# Altium project Display_V1_1.PrjPcb
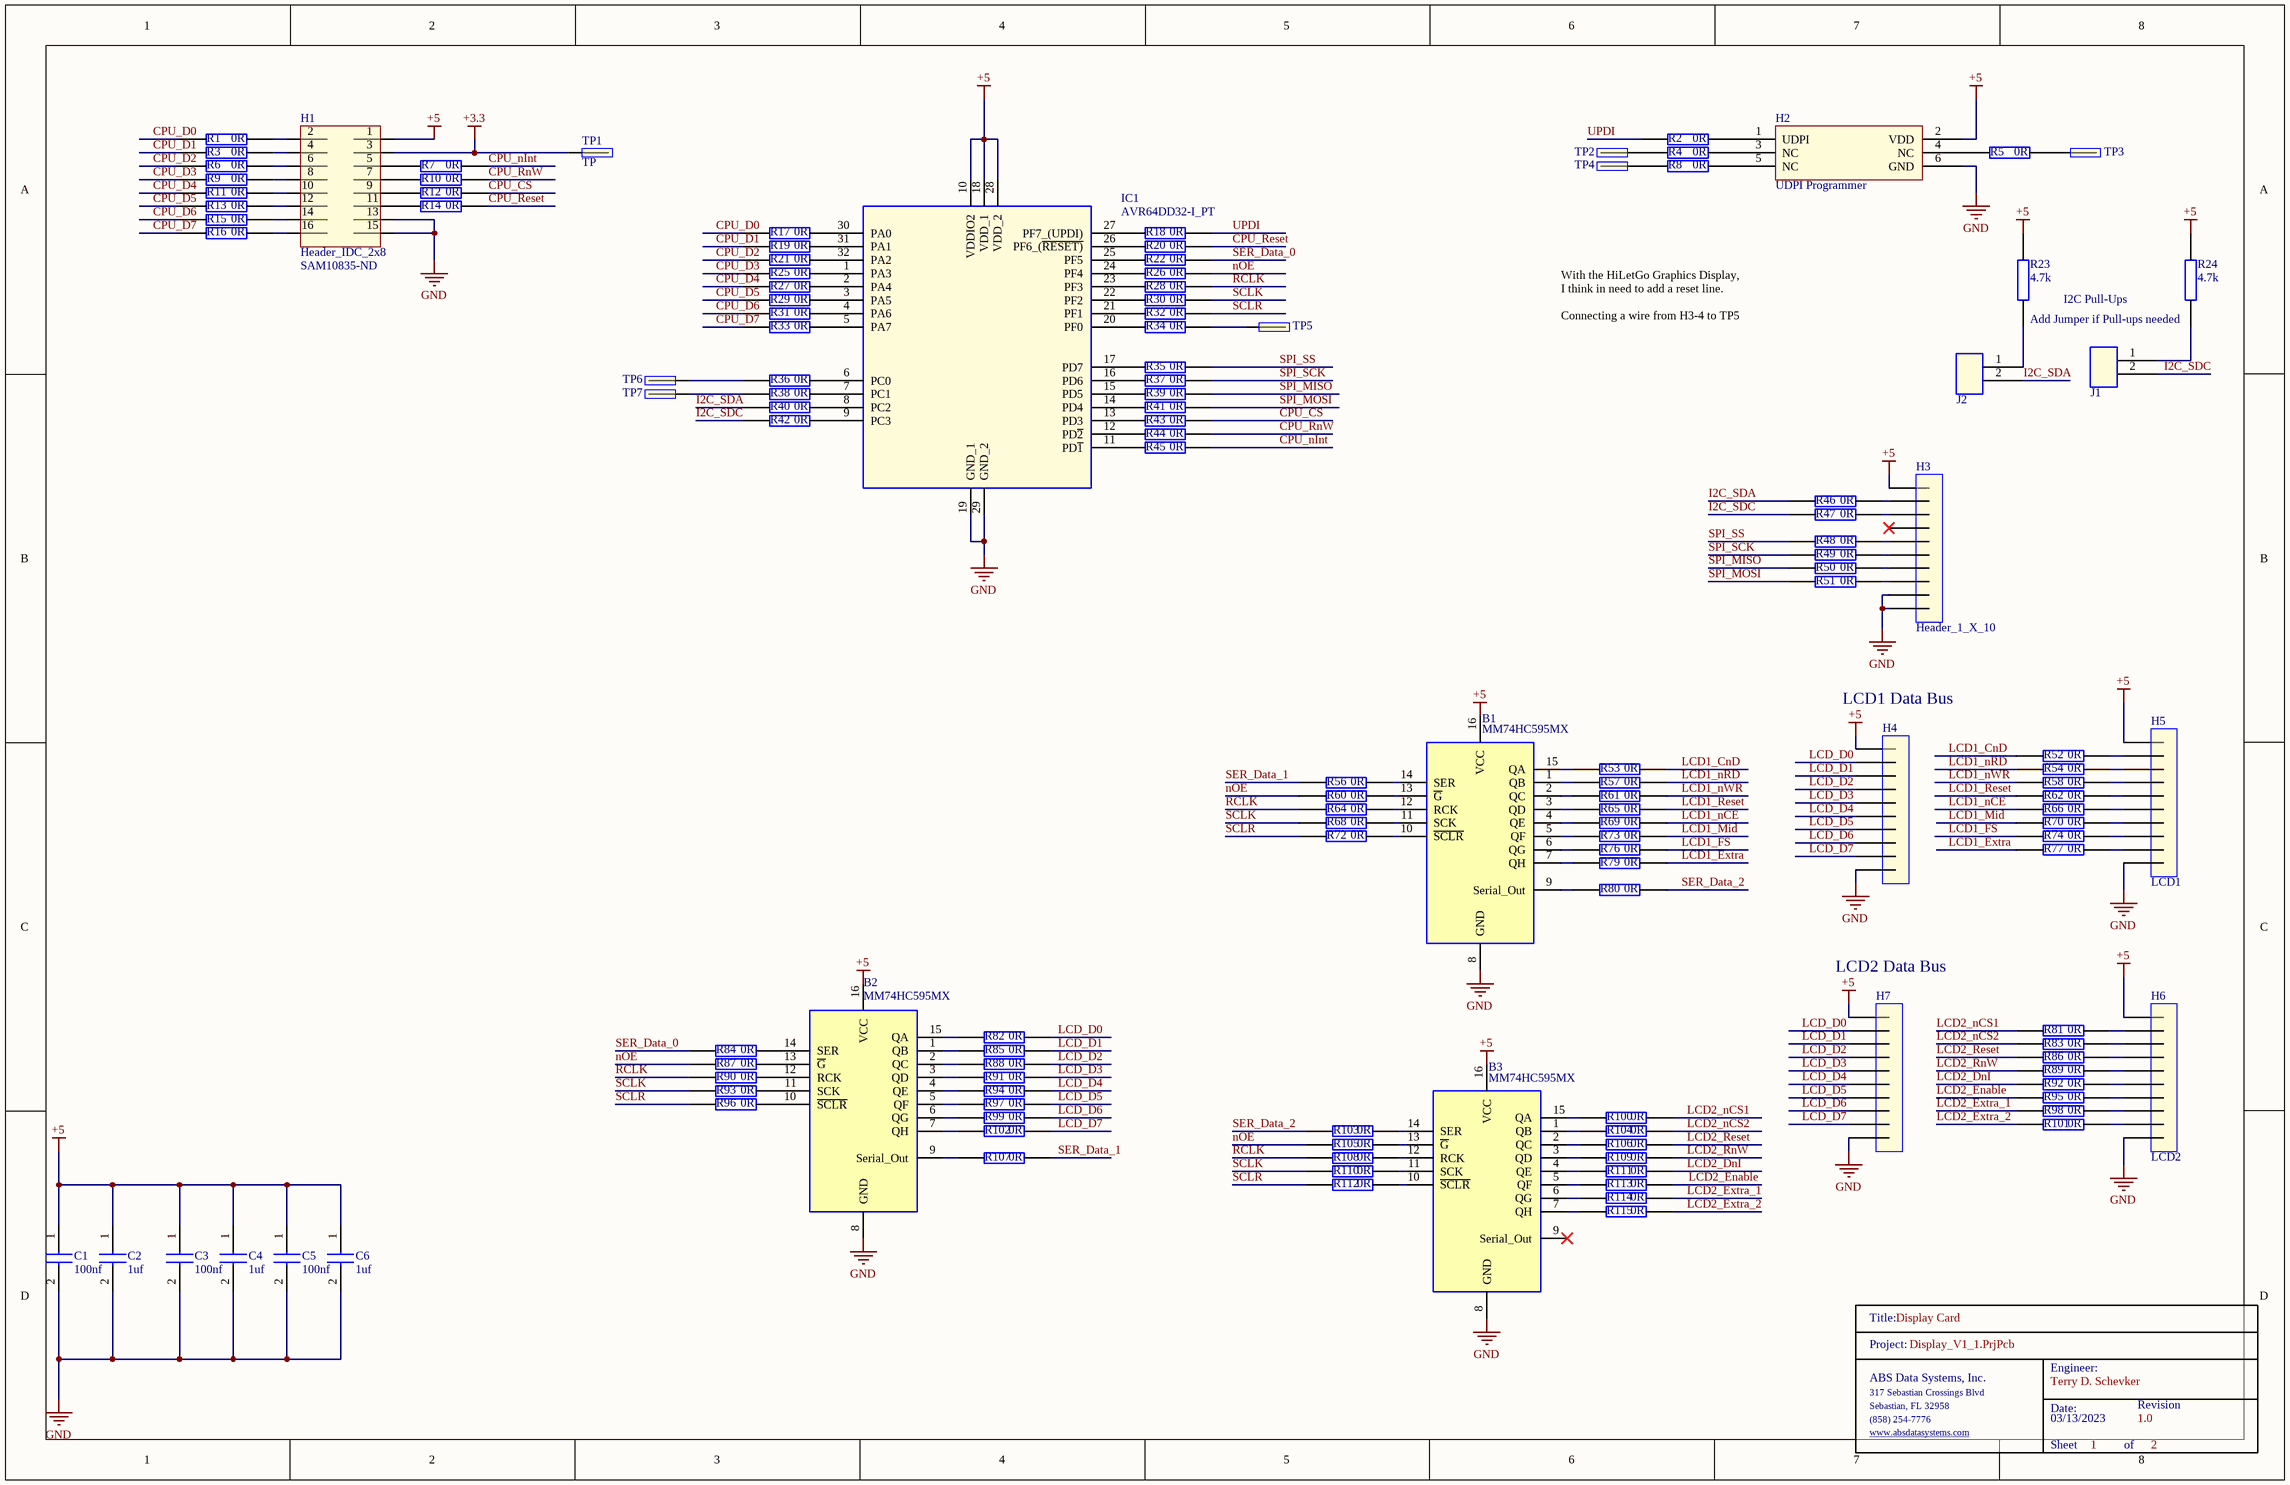
[diagram p0: Display_CPu.SchDoc]
2 sheets, 314 parts. Net scope: global (net labels, ports and power ports of the same name join across sheets).
Board file: Display_PCB.PcbDoc
Sheets:
  Display_CPu.SchDoc
  Display_LED_Monitor.SchDoc

## Sheet Display_CPu.SchDoc: Display Card
size Tabloid; Date: 03/13/2023; Engineer: Terry D. Schevker; Address4: Display Card; Revision: 1.0; SheetNumber: 1; SheetTotal: 2

### Parts
B1  MM74HC595MX  [SOIC127P600X175-16N]
B2  MM74HC595MX  [SOIC127P600X175-16N]
B3  MM74HC595MX  [SOIC127P600X175-16N]
C1  100nf  [0603]
C2  1uf  [0603]
C3  100nf  [0603]
C4  1uf  [0603]
C5  100nf  [0603]
C6  1uf  [0603]
H1  Header_IDC_2x8  Supplier Part Number 1: SAM10835-ND  [HEADER16]
H2  UDPI Programmer  [HDR2X3]
H3  Header_1_X_10  [TP_1X10]
H4  Header_1_X_10  [TP_1X10]  (value not drawn)
H5  LCD1  [TP_1X10]
H6  LCD2  [TP_1X10]
H7  Header_1_X_10  [TP_1X10]  (value not drawn)
IC1  AVR64DD32-I_PT  [QFP80P900X900X120-32N]
J1  Jumper  [Jumper]  (value not drawn)
J2  Jumper  [Jumper]  (value not drawn)
R1  0R  [0603]
R2  0R  [0603]
R3  0R  [0603]
R4  0R  [0603]
R5  0R  [0603]
R6  0R  [0603]
R7  0R  [0603]
R8  0R  [0603]
R9  0R  [0603]
R10  0R  [0603]
R11  0R  [0603]
R12  0R  [0603]
R13  0R  [0603]
R14  0R  [0603]
R15  0R  [0603]
R16  0R  [0603]
R17  0R  [0603]
R18  0R  [0603]
R19  0R  [0603]
R20  0R  [0603]
R21  0R  [0603]
R22  0R  [0603]
R23  4.7k  [0603]
R24  4.7k  [0603]
R25  0R  [0603]
R26  0R  [0603]
R27  0R  [0603]
R28  0R  [0603]
R29  0R  [0603]
R30  0R  [0603]
R31  0R  [0603]
R32  0R  [0603]
R33  0R  [0603]
R34  0R  [0603]
R35  0R  [0603]
R36  0R  [0603]
R37  0R  [0603]
R38  0R  [0603]
R39  0R  [0603]
R40  0R  [0603]
R41  0R  [0603]
R42  0R  [0603]
R43  0R  [0603]
R44  0R  [0603]
R45  0R  [0603]
R46  0R  [0603]
R47  0R  [0603]
R48  0R  [0603]
R49  0R  [0603]
R50  0R  [0603]
R51  0R  [0603]
R52  0R  [0603]
R53  0R  [0603]
R54  0R  [0603]
R56  0R  [0603]
R57  0R  [0603]
R58  0R  [0603]
R60  0R  [0603]
R61  0R  [0603]
R62  0R  [0603]
R64  0R  [0603]
R65  0R  [0603]
R66  0R  [0603]
R68  0R  [0603]
R69  0R  [0603]
R70  0R  [0603]
R72  0R  [0603]
R73  0R  [0603]
R74  0R  [0603]
R76  0R  [0603]
R77  0R  [0603]
R79  0R  [0603]
R80  0R  [0603]
R81  0R  [0603]
R82  0R  [0603]
R83  0R  [0603]
R84  0R  [0603]
R85  0R  [0603]
R86  0R  [0603]
R87  0R  [0603]
R88  0R  [0603]
R89  0R  [0603]
R90  0R  [0603]
R91  0R  [0603]
R92  0R  [0603]
R93  0R  [0603]
R94  0R  [0603]
R95  0R  [0603]
R96  0R  [0603]
R97  0R  [0603]
R98  0R  [0603]
R99  0R  [0603]
R100  0R  [0603]
R101  0R  [0603]
R102  0R  [0603]
R103  0R  [0603]
R104  0R  [0603]
R105  0R  [0603]
R106  0R  [0603]
R107  0R  [0603]
R108  0R  [0603]
R109  0R  [0603]
R110  0R  [0603]
R111  0R  [0603]
R112  0R  [0603]
R113  0R  [0603]
R114  0R  [0603]
R115  0R  [0603]
TitleBlock_1  TitleBlock  (value not drawn)  (graphical)
TP1  TP  [TP]
TP2  TP  [TP]  (value not drawn)
TP3  TP  [TP]  (value not drawn)
TP4  TP  [TP]  (value not drawn)
TP5  TP  [TP]  (value not drawn)
TP6  TP  [TP]  (value not drawn)
TP7  TP  [TP]  (value not drawn)

### Nets
+3.3: H1.3 TP1.1
+5: B1.16(VCC) B2.16(VCC) B3.16(VCC) C1.1 C2.1 C3.1 C4.1 C5.1 C6.1 H1.1 H2.2(VDD) H3.1 H4.1 H5.1 H6.1 H7.1 IC1.10(VDDIO2) IC1.18(VDD_1) IC1.28(VDD_2) R23.2 R24.2
GND: B1.8(GND) B2.8(GND) B3.8(GND) C1.2 C2.2 C3.2 C4.2 C5.2 C6.2 H1.13 H1.15 H2.6(GND) H3.9 H3.10 H4.10 H5.10 H6.10 H7.10 IC1.19(GND_1) IC1.29(GND_2)
CPU_CS: R12.2 R43.2
CPU_D0: R1.1 R17.1
CPU_D1: R3.1 R19.1
CPU_D2: R6.1 R21.1
CPU_D3: R9.1 R25.1
CPU_D4: R11.1 R27.1
CPU_D5: R13.1 R29.1
CPU_D6: R15.1 R31.1
CPU_D7: R16.1 R33.1
CPU_nInt: R7.2 R45.2
CPU_Reset: R14.2 R20.2
CPU_RnW: R10.2 R44.2
I2C_SDA: J2.2 R40.1 R46.1
I2C_SDC: J1.2 R42.1 R47.1
LCD1_CnD: R52.1 R53.2
LCD1_Extra: R77.1 R79.2
LCD1_FS: R74.1 R76.2
LCD1_Mid: R70.1 R73.2
LCD1_nCE: R66.1 R69.2
LCD1_nRD: R54.1 R57.2
LCD1_nWR: R58.1 R61.2
LCD1_Reset: R62.1 R65.2
LCD2_DnI: R92.1 R111.2
LCD2_Enable: R95.1 R113.2
LCD2_Extra_1: R98.1 R114.2
LCD2_Extra_2: R101.1 R115.2
LCD2_nCS1: R81.1 R100.2
LCD2_nCS2: R83.1 R104.2
LCD2_Reset: R86.1 R106.2
LCD2_RnW: R89.1 R109.2
LCD_D0: H4.2 H7.2 R82.2
LCD_D1: H4.3 H7.3 R85.2
LCD_D2: H4.4 H7.4 R88.2
LCD_D3: H4.5 H7.5 R91.2
LCD_D4: H4.6 H7.6 R94.2
LCD_D5: H4.7 H7.7 R97.2
LCD_D6: H4.8 H7.8 R99.2
LCD_D7: H4.9 H7.9 R102.2
nOE: R26.2 R60.1 R87.1 R105.1
RCLK: R28.2 R64.1 R90.1 R108.1
SCLK: R30.2 R68.1 R93.1 R110.1
SCLR: R32.2 R72.1 R96.1 R112.1
SER_Data_0: R22.2 R84.1
SER_Data_1: R56.1 R107.2
SER_Data_2: R80.2 R103.1
SPI_MISO: R39.2 R50.1
SPI_MOSI: R41.2 R51.1
SPI_SCK: R37.2 R49.1
SPI_SS: R35.2 R48.1
UPDI: R2.1 R18.2
NetB1_1: B1.1(QB) R57.1
NetB1_2: B1.2(QC) R61.1
NetB1_3: B1.3(QD) R65.1
NetB1_4: B1.4(QE) R69.1
NetB1_5: B1.5(QF) R73.1
NetB1_6: B1.6(QG) R76.1
NetB1_7: B1.7(QH) R79.1
NetB1_9: B1.9(Serial_Out) R80.1
NetB1_10: B1.10(~{SCLR}) R72.2
NetB1_11: B1.11(SCK) R68.2
NetB1_12: B1.12(RCK) R64.2
NetB1_13: B1.13(~{G}) R60.2
NetB1_14: B1.14(SER) R56.2
NetB1_15: B1.15(QA) R53.1
NetB2_1: B2.1(QB) R85.1
NetB2_2: B2.2(QC) R88.1
NetB2_3: B2.3(QD) R91.1
NetB2_4: B2.4(QE) R94.1
NetB2_5: B2.5(QF) R97.1
NetB2_6: B2.6(QG) R99.1
NetB2_7: B2.7(QH) R102.1
NetB2_9: B2.9(Serial_Out) R107.1
NetB2_10: B2.10(~{SCLR}) R96.2
NetB2_11: B2.11(SCK) R93.2
NetB2_12: B2.12(RCK) R90.2
NetB2_13: B2.13(~{G}) R87.2
NetB2_14: B2.14(SER) R84.2
NetB2_15: B2.15(QA) R82.1
NetB3_1: B3.1(QB) R104.1
NetB3_2: B3.2(QC) R106.1
NetB3_3: B3.3(QD) R109.1
NetB3_4: B3.4(QE) R111.1
NetB3_5: B3.5(QF) R113.1
NetB3_6: B3.6(QG) R114.1
NetB3_7: B3.7(QH) R115.1
NetB3_10: B3.10(~{SCLR}) R112.2
NetB3_11: B3.11(SCK) R110.2
NetB3_12: B3.12(RCK) R108.2
NetB3_13: B3.13(~{G}) R105.2
NetB3_14: B3.14(SER) R103.2
NetB3_15: B3.15(QA) R100.1
NetH1_2: H1.2 R1.2
NetH1_4: H1.4 R3.2
NetH1_5: H1.5 R7.1
NetH1_6: H1.6 R6.2
NetH1_7: H1.7 R10.1
NetH1_8: H1.8 R9.2
NetH1_9: H1.9 R12.1
NetH1_10: H1.10 R11.2
NetH1_11: H1.11 R14.1
NetH1_12: H1.12 R13.2
NetH1_14: H1.14 R15.2
NetH1_16: H1.16 R16.2
NetH2_1: H2.1(UDPI) R2.2
NetH2_3: H2.3(NC) R4.2
NetH2_4: H2.4(NC) R5.1
NetH2_5: H2.5(NC) R8.2
NetH3_2: H3.2 R46.2
NetH3_3: H3.3 R47.2
NetH3_5: H3.5 R48.2
NetH3_6: H3.6 R49.2
NetH3_7: H3.7 R50.2
NetH3_8: H3.8 R51.2
NetH5_2: H5.2 R52.2
NetH5_3: H5.3 R54.2
NetH5_4: H5.4 R58.2
NetH5_5: H5.5 R62.2
NetH5_6: H5.6 R66.2
NetH5_7: H5.7 R70.2
NetH5_8: H5.8 R74.2
NetH5_9: H5.9 R77.2
NetH6_2: H6.2 R81.2
NetH6_3: H6.3 R83.2
NetH6_4: H6.4 R86.2
NetH6_5: H6.5 R89.2
NetH6_6: H6.6 R92.2
NetH6_7: H6.7 R95.2
NetH6_8: H6.8 R98.2
NetH6_9: H6.9 R101.2
NetIC1_1: IC1.1(PA3) R25.2
NetIC1_2: IC1.2(PA4) R27.2
NetIC1_3: IC1.3(PA5) R29.2
NetIC1_4: IC1.4(PA6) R31.2
NetIC1_5: IC1.5(PA7) R33.2
NetIC1_6: IC1.6(PC0) R36.2
NetIC1_7: IC1.7(PC1) R38.2
NetIC1_8: IC1.8(PC2) R40.2
NetIC1_9: IC1.9(PC3) R42.2
NetIC1_11: IC1.11(PD~{1}) R45.1
NetIC1_12: IC1.12(PD~{2}) R44.1
NetIC1_13: IC1.13(PD3) R43.1
NetIC1_14: IC1.14(PD4) R41.1
NetIC1_15: IC1.15(PD5) R39.1
NetIC1_16: IC1.16(PD6) R37.1
NetIC1_17: IC1.17(PD7) R35.1
NetIC1_20: IC1.20(PF0) R34.1
NetIC1_21: IC1.21(PF1) R32.1
NetIC1_22: IC1.22(PF2) R30.1
NetIC1_23: IC1.23(PF3) R28.1
NetIC1_24: IC1.24(PF4) R26.1
NetIC1_25: IC1.25(PF5) R22.1
NetIC1_26: IC1.26(PF6_(~{RESET)}) R20.1
NetIC1_27: IC1.27(PF7_(UPDI)) R18.1
NetIC1_30: IC1.30(PA0) R17.2
NetIC1_31: IC1.31(PA1) R19.2
NetIC1_32: IC1.32(PA2) R21.2
NetJ1_1: J1.1 R24.1
NetJ2_1: J2.1 R23.1
NetR4_1: R4.1 TP2.1
NetR5_2: R5.2 TP3.1
NetR8_1: R8.1 TP4.1
NetR34_2: R34.2 TP5.1
NetR36_1: R36.1 TP6.1
NetR38_1: R38.1 TP7.1

Not connected (* = marked no-connect by the designer): B3 9(Serial_Out)*; H3 4*

### Notes on the sheet
- I2C Pull-Ups
- Add Jumper if Pull-ups needed
- With the HiLetGo Graphics Display, I think in need to add a reset line.
  Connecting a wire from H3-4 to TP5
- (near H4) LCD1 Data Bus
- (near H7) LCD2 Data Bus
- (in symbol TitleBlock) Title:; Project:; Engineer:; ABS Data Systems, Inc.; 317 Sebastian Crossings Blvd; Sebastian, FL 32958; Date:; Revision; (858) 254-7776; www.absdatasystems.com; Sheet; of

### Library data of the parts
B1-B3 = MM74HC595MX: Shift Register HS 8 Bit CMOS SOIC16; Manufacturer_Name: onsemi; Geometry.Height: 1.75mm; Mouser Part Number: 512-MM74HC595MX; Mouser Price/Stock: https://www.mouser.co.uk/ProductDetail/onsemi-Fairchild/MM74HC595MX?qs=Qb0BA3xILelPReDH8l7J4w%3D%3D; Manufacturer_Part_Number: MM74HC595MX; Datasheet Link: *
C1 C3 C5 = CL10B104JB8NNNC: Samsung Electro-Mechanics 0603 100nf
C2 C4 C6 = CL10B105KA8NNNL: Samsung Electro-Mechanics 0603 1uf
H1 = Header_IDC_2x8: 16 Pin 2x8 Through Hold IDC Connector; Manufacturer: Samtec; Manufacturer Part Number: TST-108-01-G-D; Number of Contacts: 16; Gender: Male; Connector Type: Male Pin; Pitch: 2.54mm; Row Spacing: 0.1inch; Supplier 1: Digi-Key; RoHS: Yes; Category: Headers and Wire Housings; Stock 1: 227; Pricing 1: 1=2.85000, 10=2.73600, 100=2.28000, 500=1.93800, 1000=1.65300, 5000=1.48200 (USD); Mount: Through Hole; Contact Plating: Gold; Contact Material: Bronze; Housing Material: Polyester; Housing Color: Black; Color: Black; Min Operating Temperature: -55°C; Max Operating Temperature: 125°C; Number of Rows: 2; Termination: Solder; Packaging: Rail/Tube; Orientation: Straight; Number of Positions: 16; Length: 27.94mm; Depth: 9.27mm; Contact Mating Length: 0.25inch; REACH SVHC: No SVHC; ComponentLink1URL: https://datasheet.ciiva.com/739/tst-mkt-739845.pdf?src-supplier=Digi-Key; ComponentLink1Description: https://datasheet.ciiva.com/739/tst-mkt-739845.pdf?src-supplier=Digi-Key; ComponentLink2URL: https://datasheet.ciiva.com/10018/htst-10018510.pdf?src-supplier=Avnet; ComponentLink2Description: https://datasheet.ciiva.com/10018/htst-10018510.pdf?src-supplier=Avnet
H2 = UDPI Programmer: 6 Pin 2X3 Through Hole Header
H3-H7 = Header_1_X_10: Manufacturer: Samtec; Manufacturer Part Number: TST-105-01-G-D; Number of Contacts: 16; Gender: Male; Connector Type: Male Pin; Pitch: 2.54mm; Row Spacing: 0.1inch; Supplier 1: Digi-Key; RoHS: Yes; Category: Headers and Wire Housings; Stock 1: 227; Pricing 1: 1=2.85000, 10=2.73600, 100=2.28000, 500=1.93800, 1000=1.65300, 5000=1.48200 (USD); Mount: Through Hole; Contact Plating: Gold; Contact Material: Bronze; Housing Material: Polyester; Housing Color: Black; Color: Black; Min Operating Temperature: -55°C; Max Operating Temperature: 125°C; Number of Rows: 2; Termination: Solder; Packaging: Rail/Tube; Orientation: Straight; Number of Positions: 16; Length: 27.94mm; Depth: 9.27mm; Contact Mating Length: 0.25inch; REACH SVHC: No SVHC; ComponentLink1URL: https://datasheet.ciiva.com/739/tst-mkt-739845.pdf?src-supplier=Digi-Key; ComponentLink1Description: https://datasheet.ciiva.com/739/tst-mkt-739845.pdf?src-supplier=Digi-Key; ComponentLink2URL: https://datasheet.ciiva.com/10018/htst-10018510.pdf?src-supplier=Avnet; ComponentLink2Description: https://datasheet.ciiva.com/10018/htst-10018510.pdf?src-supplier=Avnet
IC1 = AVR64DD32-I_PT: Integrated Circuit; Manufacturer_Name: Microchip; Manufacturer_Part_Number: AVR64DD32-I/PT | MULTI-VOLTAGE I/O; Datasheet Link: https://www.microchip.com/en-us/product/AVR64DD32; Height: 1.2mm
J1 J2 = Jumper: 16 Pin 3x8 Through Hold Jumprts; Manufacturer: Samtec; Manufacturer Part Number: TST-108-01-G-D; Number of Contacts: 16; Gender: Male; Connector Type: Male Pin; Pitch: 2.54mm; Row Spacing: 0.1inch; Supplier 1: Digi-Key; RoHS: Yes; Category: Headers and Wire Housings; Stock 1: 227; Pricing 1: 1=2.85000, 10=2.73600, 100=2.28000, 500=1.93800, 1000=1.65300, 5000=1.48200 (USD); Mount: Through Hole; Contact Plating: Gold; Contact Material: Bronze; Housing Material: Polyester; Housing Color: Black; Color: Black; Min Operating Temperature: -55°C; Max Operating Temperature: 125°C; Number of Rows: 2; Termination: Solder; Packaging: Rail/Tube; Orientation: Straight; Number of Positions: 16; Length: 27.94mm; Depth: 9.27mm; Contact Mating Length: 0.25inch; REACH SVHC: No SVHC; ComponentLink1URL: https://datasheet.ciiva.com/739/tst-mkt-739845.pdf?src-supplier=Digi-Key; ComponentLink1Description: https://datasheet.ciiva.com/739/tst-mkt-739845.pdf?src-supplier=Digi-Key; ComponentLink2URL: https://datasheet.ciiva.com/10018/htst-10018510.pdf?src-supplier=Avnet; ComponentLink2Description: https://datasheet.ciiva.com/10018/htst-10018510.pdf?src-supplier=Avnet
R1-R22 R25-R54 R56-R58 R60-R62 R64-R66 R68-R70 R72-R74 R76 R77 R79-R115 = RC0603JR-070RL: YAGEO 0603 0 ohm; Manufacturer_Name: KEMET; Geometry.Height: 0.55mm; Mouser Part Number: 603-RC0603JR-070RL; Mouser Price/Stock: https://www.mouser.co.uk/ProductDetail/YAGEO/RC0603JR-070RL?qs=2cAdsCoAWRGWyPcuXgGiXQ%3D%3D; Manufacturer_Part_Number: RC0603JR-070RL; Datasheet Link: https://datasheet.datasheetarchive.com/originals/distributors/Datasheets_SAMA/902f9e387b938f871d31120f5fc1d65e.pdf
R23 R24 = RC0603FR-104K7L: YAGEO 0603 4.7k; Manufacturer_Name: KEMET; Manufacturer_Part_Number: RC0603JR-070RL; Geometry.Height: 0.55mm; Mouser Part Number: 603-RC0603JR-070RL; Mouser Price/Stock: https://www.mouser.co.uk/ProductDetail/YAGEO/RC0603JR-070RL?qs=2cAdsCoAWRGWyPcuXgGiXQ%3D%3D; Datasheet Link: https://datasheet.datasheetarchive.com/originals/distributors/Datasheets_SAMA/902f9e387b938f871d31120f5fc1d65e.pdf
TP1-TP7 = TP: Manufacturer: Samtec; Manufacturer Part Number: TST-105-01-G-D; Number of Contacts: 16; Gender: Male; Connector Type: Male Pin; Pitch: 2.54mm; Row Spacing: 0.1inch; Supplier 1: Digi-Key; RoHS: Yes; Category: Headers and Wire Housings; Stock 1: 227; Pricing 1: 1=2.85000, 10=2.73600, 100=2.28000, 500=1.93800, 1000=1.65300, 5000=1.48200 (USD); Mount: Through Hole; Contact Plating: Gold; Contact Material: Bronze; Housing Material: Polyester; Housing Color: Black; Color: Black; Min Operating Temperature: -55°C; Max Operating Temperature: 125°C; Number of Rows: 2; Termination: Solder; Packaging: Rail/Tube; Orientation: Straight; Number of Positions: 16; Length: 27.94mm; Depth: 9.27mm; Contact Mating Length: 0.25inch; REACH SVHC: No SVHC; ComponentLink1URL: https://datasheet.ciiva.com/739/tst-mkt-739845.pdf?src-supplier=Digi-Key; ComponentLink1Description: https://datasheet.ciiva.com/739/tst-mkt-739845.pdf?src-supplier=Digi-Key; ComponentLink2URL: https://datasheet.ciiva.com/10018/htst-10018510.pdf?src-supplier=Avnet; ComponentLink2Description: https://datasheet.ciiva.com/10018/htst-10018510.pdf?src-supplier=Avnet

## Sheet Display_LED_Monitor.SchDoc: Display LED Monitor
size Tabloid; Date: 05/10/2023; Engineer: Terry D. Schevker; Revision: 1.0; SheetNumber: 2; SheetTotal: 2
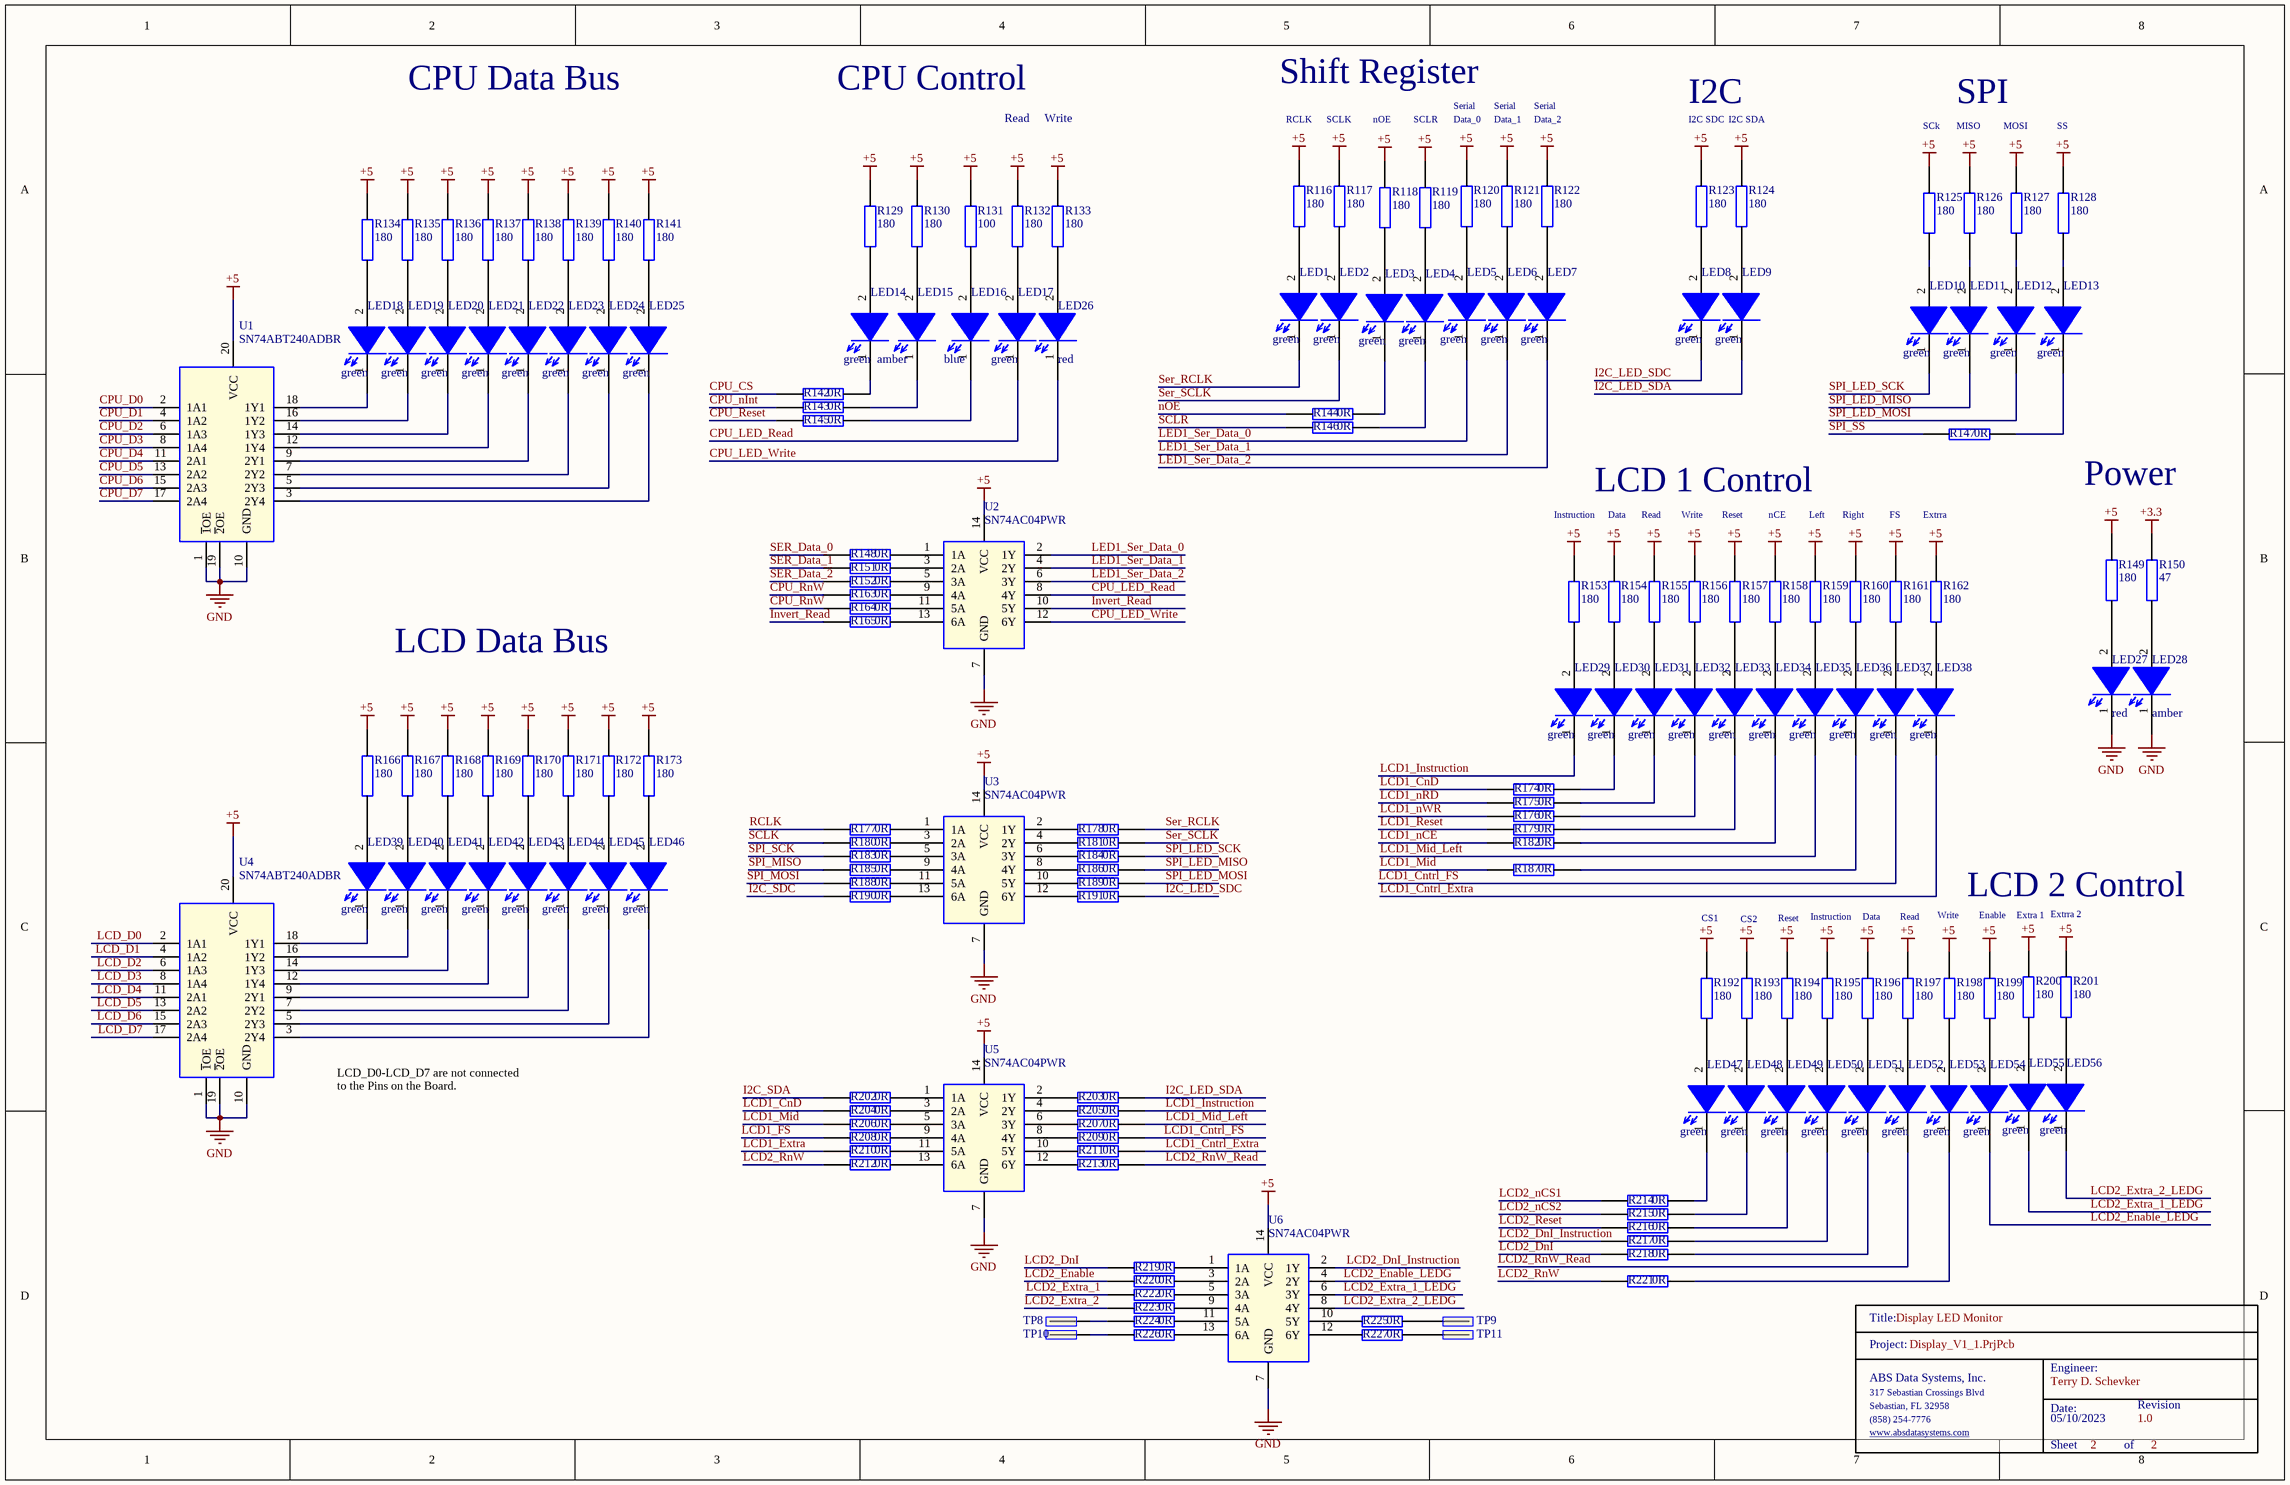
[diagram p1: Display_LED_Monitor.SchDoc]

### Parts
LED1  green  [0603_Diode]
LED2  green  [0603_Diode]
LED3  green  [0603_Diode]
LED4  green  [0603_Diode]
LED5  green  [0603_Diode]
LED6  green  [0603_Diode]
LED7  green  [0603_Diode]
LED8  green  [0603_Diode]
LED9  green  [0603_Diode]
LED10  green  [0603_Diode]
LED11  green  [0603_Diode]
LED12  green  [0603_Diode]
LED13  green  [0603_Diode]
LED14  green  [0603_Diode]
LED15  amber  [0603_Diode]
LED16  blue  [0603_Diode]
LED17  green  [0603_Diode]
LED18  green  [0603_Diode]
LED19  green  [0603_Diode]
LED20  green  [0603_Diode]
LED21  green  [0603_Diode]
LED22  green  [0603_Diode]
LED23  green  [0603_Diode]
LED24  green  [0603_Diode]
LED25  green  [0603_Diode]
LED26  red  [0603_Diode]
LED27  red  [0603_Diode]
LED28  amber  [0603_Diode]
LED29  green  [0603_Diode]
LED30  green  [0603_Diode]
LED31  green  [0603_Diode]
LED32  green  [0603_Diode]
LED33  green  [0603_Diode]
LED34  green  [0603_Diode]
LED35  green  [0603_Diode]
LED36  green  [0603_Diode]
LED37  green  [0603_Diode]
LED38  green  [0603_Diode]
LED39  green  [0603_Diode]
LED40  green  [0603_Diode]
LED41  green  [0603_Diode]
LED42  green  [0603_Diode]
LED43  green  [0603_Diode]
LED44  green  [0603_Diode]
LED45  green  [0603_Diode]
LED46  green  [0603_Diode]
LED47  green  [0603_Diode]
LED48  green  [0603_Diode]
LED49  green  [0603_Diode]
LED50  green  [0603_Diode]
LED51  green  [0603_Diode]
LED52  green  [0603_Diode]
LED53  green  [0603_Diode]
LED54  green  [0603_Diode]
LED55  green  [0603_Diode]
LED56  green  [0603_Diode]
R116  180  [0603]
R117  180  [0603]
R118  180  [0603]
R119  180  [0603]
R120  180  [0603]
R121  180  [0603]
R122  180  [0603]
R123  180  [0603]
R124  180  [0603]
R125  180  [0603]
R126  180  [0603]
R127  180  [0603]
R128  180  [0603]
R129  180  [0603]
R130  180  [0603]
R131  100  [0603]
R132  180  [0603]
R133  180  [0603]
R134  180  [0603]
R135  180  [0603]
R136  180  [0603]
R137  180  [0603]
R138  180  [0603]
R139  180  [0603]
R140  180  [0603]
R141  180  [0603]
R142  0R  [0603]
R143  0R  [0603]
R144  0R  [0603]
R145  0R  [0603]
R146  0R  [0603]
R147  0R  [0603]
R148  0R  [0603]
R149  180  [0603]
R150  47  [0603]
R151  0R  [0603]
R152  0R  [0603]
R153  180  [0603]
R154  180  [0603]
R155  180  [0603]
R156  180  [0603]
R157  180  [0603]
R158  180  [0603]
R159  180  [0603]
R160  180  [0603]
R161  180  [0603]
R162  180  [0603]
R163  0R  [0603]
R164  0R  [0603]
R165  0R  [0603]
R166  180  [0603]
R167  180  [0603]
R168  180  [0603]
R169  180  [0603]
R170  180  [0603]
R171  180  [0603]
R172  180  [0603]
R173  180  [0603]
R174  0R  [0603]
R175  0R  [0603]
R176  0R  [0603]
R177  0R  [0603]
R178  0R  [0603]
R179  0R  [0603]
R180  0R  [0603]
R181  0R  [0603]
R182  0R  [0603]
R183  0R  [0603]
R184  0R  [0603]
R185  0R  [0603]
R186  0R  [0603]
R187  0R  [0603]
R188  0R  [0603]
R189  0R  [0603]
R190  0R  [0603]
R191  0R  [0603]
R192  180  [0603]
R193  180  [0603]
R194  180  [0603]
R195  180  [0603]
R196  180  [0603]
R197  180  [0603]
R198  180  [0603]
R199  180  [0603]
R200  180  [0603]
R201  180  [0603]
R202  0R  [0603]
R203  0R  [0603]
R204  0R  [0603]
R205  0R  [0603]
R206  0R  [0603]
R207  0R  [0603]
R208  0R  [0603]
R209  0R  [0603]
R210  0R  [0603]
R211  0R  [0603]
R212  0R  [0603]
R213  0R  [0603]
R214  0R  [0603]
R215  0R  [0603]
R216  0R  [0603]
R217  0R  [0603]
R218  0R  [0603]
R219  0R  [0603]
R220  0R  [0603]
R221  0R  [0603]
R222  0R  [0603]
R223  0R  [0603]
R224  0R  [0603]
R225  0R  [0603]
R226  0R  [0603]
R227  0R  [0603]
TitleBlock_2  TitleBlock  (value not drawn)  (graphical)
TP8  TP  [TP]  (value not drawn)
TP9  TP  [TP]  (value not drawn)
TP10  TP  [TP]  (value not drawn)
TP11  TP  [TP]  (value not drawn)
U1  SN74ABT240ADBR  [SOP65P780X200-20N]
U2  SN74AC04PWR  [SOP65P640X120-14N]
U3  SN74AC04PWR  [SOP65P640X120-14N]
U4  SN74ABT240ADBR  [SOP65P780X200-20N]
U5  SN74AC04PWR  [SOP65P640X120-14N]
U6  SN74AC04PWR  [SOP65P640X120-14N]

### Nets
+3.3: R150.1
+5: R116.2 R117.2 R118.2 R119.2 R120.2 R121.2 R122.2 R123.2 R124.2 R125.2 R126.2 R127.2 R128.2 R129.2 R130.2 R131.1 R132.2 R133.2 R134.2 R135.2 R136.2 R137.2 R138.2 R139.2 R140.2 R141.2 R149.2 R153.2 R154.2 R155.2 R156.2 R157.2 R158.2 R159.2 R160.2 R161.2 R162.2 R166.2 R167.2 R168.2 R169.2 R170.2 R171.2 R172.2 R173.2 R192.2 R193.2 R194.2 R195.2 R196.2 R197.2 R198.2 R199.2 R200.2 R201.2 U1.20(VCC) U2.14(VCC) U3.14(VCC) U4.20(VCC) U5.14(VCC) U6.14(VCC)
GND: LED27.1(K) LED28.1(K) U1.1(~{1}OE) U1.10(GND) U1.19(~{2}OE) U2.7(GND) U3.7(GND) U4.1(~{1}OE) U4.10(GND) U4.19(~{2}OE) U5.7(GND) U6.7(GND)
CPU_CS: R142.1
CPU_D0: U1.2(1A1)
CPU_D1: U1.4(1A2)
CPU_D2: U1.6(1A3)
CPU_D3: U1.8(1A4)
CPU_D4: U1.11(2A1)
CPU_D5: U1.13(2A2)
CPU_D6: U1.15(2A3)
CPU_D7: U1.17(2A4)
CPU_LED_Read: LED17.1(K) U2.8(4Y)
CPU_LED_Write: LED26.1(K) U2.12(6Y)
CPU_nInt: R143.1
CPU_Reset: R145.1
CPU_RnW: R163.1 R164.1
I2C_LED_SDA: LED9.1(K) R203.2
I2C_LED_SDC: LED8.1(K) R191.2
I2C_SDA: R202.1
I2C_SDC: R190.1
Invert_Read: R165.1 U2.10(5Y)
LCD1_CnD: R174.1 R204.1
LCD1_Cntrl_Extra: LED38.1(K) R211.2
LCD1_Cntrl_FS: LED37.1(K) R209.2
LCD1_Extra: R210.1
LCD1_FS: R208.1
LCD1_Instruction: LED29.1(K) R205.2
LCD1_Mid: R187.1 R206.1
LCD1_Mid_Left: LED35.1(K) R207.2
LCD1_nCE: R182.1
LCD1_nRD: R175.1
LCD1_nWR: R176.1
LCD1_Reset: R179.1
LCD2_DnI: R218.1 R219.1
LCD2_DnI_Instruction: R217.1 U6.2(1Y)
LCD2_Enable: R220.1
LCD2_Enable_LEDG: LED54.1(K) U6.4(2Y)
LCD2_Extra_1: R222.1
LCD2_Extra_1_LEDG: LED55.1(K) U6.6(3Y)
LCD2_Extra_2: R223.1
LCD2_Extra_2_LEDG: LED56.1(K) U6.8(4Y)
LCD2_nCS1: R214.1
LCD2_nCS2: R215.1
LCD2_Reset: R216.1
LCD2_RnW: R212.1 R221.1
LCD2_RnW_Read: LED52.1(K) R213.2
LCD_D0: U4.2(1A1)
LCD_D1: U4.4(1A2)
LCD_D2: U4.6(1A3)
LCD_D3: U4.8(1A4)
LCD_D4: U4.11(2A1)
LCD_D5: U4.13(2A2)
LCD_D6: U4.15(2A3)
LCD_D7: U4.17(2A4)
LED1_Ser_Data_0: LED5.1(K) U2.2(1Y)
LED1_Ser_Data_1: LED6.1(K) U2.4(2Y)
LED1_Ser_Data_2: LED7.1(K) U2.6(3Y)
nOE: R144.1
RCLK: R177.1
SCLK: R180.1
SCLR: R146.1
SER_Data_0: R148.1
SER_Data_1: R151.1
SER_Data_2: R152.1
Ser_RCLK: LED1.1(K) R178.2
Ser_SCLK: LED2.1(K) R181.2
SPI_LED_MISO: LED11.1(K) R186.2
SPI_LED_MOSI: LED12.1(K) R189.2
SPI_LED_SCK: LED10.1(K) R184.2
SPI_MISO: R185.1
SPI_MOSI: R188.1
SPI_SCK: R183.1
SPI_SS: R147.1
NetLED1_2: LED1.2(A) R116.1
NetLED2_2: LED2.2(A) R117.1
NetLED3_1: LED3.1(K) R144.2
NetLED3_2: LED3.2(A) R118.1
NetLED4_1: LED4.1(K) R146.2
NetLED4_2: LED4.2(A) R119.1
NetLED5_2: LED5.2(A) R120.1
NetLED6_2: LED6.2(A) R121.1
NetLED7_2: LED7.2(A) R122.1
NetLED8_2: LED8.2(A) R123.1
NetLED9_2: LED9.2(A) R124.1
NetLED10_2: LED10.2(A) R125.1
NetLED11_2: LED11.2(A) R126.1
NetLED12_2: LED12.2(A) R127.1
NetLED13_1: LED13.1(K) R147.2
NetLED13_2: LED13.2(A) R128.1
NetLED14_1: LED14.1(K) R142.2
NetLED14_2: LED14.2(A) R129.1
NetLED15_1: LED15.1(K) R143.2
NetLED15_2: LED15.2(A) R130.1
NetLED16_1: LED16.1(K) R145.2
NetLED16_2: LED16.2(A) R131.2
NetLED17_2: LED17.2(A) R132.1
NetLED18_1: LED18.1(K) U1.18(1Y1)
NetLED18_2: LED18.2(A) R134.1
NetLED19_1: LED19.1(K) U1.16(1Y2)
NetLED19_2: LED19.2(A) R135.1
NetLED20_1: LED20.1(K) U1.14(1Y3)
NetLED20_2: LED20.2(A) R136.1
NetLED21_1: LED21.1(K) U1.12(1Y4)
NetLED21_2: LED21.2(A) R137.1
NetLED22_1: LED22.1(K) U1.9(2Y1)
NetLED22_2: LED22.2(A) R138.1
NetLED23_1: LED23.1(K) U1.7(2Y2)
NetLED23_2: LED23.2(A) R139.1
NetLED24_1: LED24.1(K) U1.5(2Y3)
NetLED24_2: LED24.2(A) R140.1
NetLED25_1: LED25.1(K) U1.3(2Y4)
NetLED25_2: LED25.2(A) R141.1
NetLED26_2: LED26.2(A) R133.1
NetLED27_2: LED27.2(A) R149.1
NetLED28_2: LED28.2(A) R150.2
NetLED29_2: LED29.2(A) R153.1
NetLED30_1: LED30.1(K) R174.2
NetLED30_2: LED30.2(A) R154.1
NetLED31_1: LED31.1(K) R175.2
NetLED31_2: LED31.2(A) R155.1
NetLED32_1: LED32.1(K) R176.2
NetLED32_2: LED32.2(A) R156.1
NetLED33_1: LED33.1(K) R179.2
NetLED33_2: LED33.2(A) R157.1
NetLED34_1: LED34.1(K) R182.2
NetLED34_2: LED34.2(A) R158.1
NetLED35_2: LED35.2(A) R159.1
NetLED36_1: LED36.1(K) R187.2
NetLED36_2: LED36.2(A) R160.1
NetLED37_2: LED37.2(A) R161.1
NetLED38_2: LED38.2(A) R162.1
NetLED39_1: LED39.1(K) U4.18(1Y1)
NetLED39_2: LED39.2(A) R166.1
NetLED40_1: LED40.1(K) U4.16(1Y2)
NetLED40_2: LED40.2(A) R167.1
NetLED41_1: LED41.1(K) U4.14(1Y3)
NetLED41_2: LED41.2(A) R168.1
NetLED42_1: LED42.1(K) U4.12(1Y4)
NetLED42_2: LED42.2(A) R169.1
NetLED43_1: LED43.1(K) U4.9(2Y1)
NetLED43_2: LED43.2(A) R170.1
NetLED44_1: LED44.1(K) U4.7(2Y2)
NetLED44_2: LED44.2(A) R171.1
NetLED45_1: LED45.1(K) U4.5(2Y3)
NetLED45_2: LED45.2(A) R172.1
NetLED46_1: LED46.1(K) U4.3(2Y4)
NetLED46_2: LED46.2(A) R173.1
NetLED47_1: LED47.1(K) R214.2
NetLED47_2: LED47.2(A) R192.1
NetLED48_1: LED48.1(K) R215.2
NetLED48_2: LED48.2(A) R193.1
NetLED49_1: LED49.1(K) R216.2
NetLED49_2: LED49.2(A) R194.1
NetLED50_1: LED50.1(K) R217.2
NetLED50_2: LED50.2(A) R195.1
NetLED51_1: LED51.1(K) R218.2
NetLED51_2: LED51.2(A) R196.1
NetLED52_2: LED52.2(A) R197.1
NetLED53_1: LED53.1(K) R221.2
NetLED53_2: LED53.2(A) R198.1
NetLED54_2: LED54.2(A) R199.1
NetLED55_2: LED55.2(A) R200.1
NetLED56_2: LED56.2(A) R201.1
NetR148_2: R148.2 U2.1(1A)
NetR151_2: R151.2 U2.3(2A)
NetR152_2: R152.2 U2.5(3A)
NetR163_2: R163.2 U2.9(4A)
NetR164_2: R164.2 U2.11(5A)
NetR165_2: R165.2 U2.13(6A)
NetR177_2: R177.2 U3.1(1A)
NetR178_1: R178.1 U3.2(1Y)
NetR180_2: R180.2 U3.3(2A)
NetR181_1: R181.1 U3.4(2Y)
NetR183_2: R183.2 U3.5(3A)
NetR184_1: R184.1 U3.6(3Y)
NetR185_2: R185.2 U3.9(4A)
NetR186_1: R186.1 U3.8(4Y)
NetR188_2: R188.2 U3.11(5A)
NetR189_1: R189.1 U3.10(5Y)
NetR190_2: R190.2 U3.13(6A)
NetR191_1: R191.1 U3.12(6Y)
NetR202_2: R202.2 U5.1(1A)
NetR203_1: R203.1 U5.2(1Y)
NetR204_2: R204.2 U5.3(2A)
NetR205_1: R205.1 U5.4(2Y)
NetR206_2: R206.2 U5.5(3A)
NetR207_1: R207.1 U5.6(3Y)
NetR208_2: R208.2 U5.9(4A)
NetR209_1: R209.1 U5.8(4Y)
NetR210_2: R210.2 U5.11(5A)
NetR211_1: R211.1 U5.10(5Y)
NetR212_2: R212.2 U5.13(6A)
NetR213_1: R213.1 U5.12(6Y)
NetR219_2: R219.2 U6.1(1A)
NetR220_2: R220.2 U6.3(2A)
NetR222_2: R222.2 U6.5(3A)
NetR223_2: R223.2 U6.9(4A)
NetR224_1: R224.1 TP8.1
NetR224_2: R224.2 U6.11(5A)
NetR225_1: R225.1 U6.10(5Y)
NetR225_2: R225.2 TP9.1
NetR226_1: R226.1 TP10.1
NetR226_2: R226.2 U6.13(6A)
NetR227_1: R227.1 U6.12(6Y)
NetR227_2: R227.2 TP11.1

### Notes on the sheet
- CPU Data Bus
- CPU Control
- Shift Register
- Read
- Write
- RCLK
- SCLK
- nOE
- SCLR
- Data_0
- Serial
- Data_1
- Data_2
- I2C
- I2C SDC
- I2C SDA
- SCk
- SPI
- MISO
- MOSI
- SS
- LCD 1 Control
- Power
- Instruction
- Data
- Reset
- nCE
- Left
- Right
- FS
- Extrra
- LCD Data Bus
- LCD 2 Control
- CS1
- CS2
- Enable
- Extra 1
- Extrra 2
- LCD_D0-LCD_D7 are not connected to the Pins on the Board.
- (in symbol TitleBlock) Title:; Project:; Engineer:; ABS Data Systems, Inc.; 317 Sebastian Crossings Blvd; Sebastian, FL 32958; Date:; Revision; (858) 254-7776; www.absdatasystems.com; Sheet; of

### Library data of the parts
LED1-LED14 LED17-LED25 LED29-LED56 = 150060GS75000: Wurth Elektronik 0603 green; Manufacturer: Wurth Electronics; Wavelength: 520nm; Viewing Angle: 140°; Lens Style: Clear,Rectangular; Luminous Intensity: 430mcd; Forward Current: 30mA; Forward Voltage: 3.2V; Test Current: 20mA; Supplier 1: Digi-Key; Manufacturer Part Number: 150060GS75000; RoHS: Yes; Category: LEDs; Stock 1: 71509; Pricing 1: 1=0.14000, 50=0.13300, 100=0.11400, 500=0.09900 (USD); Mount: Surface Mount; Case/Package: 0603; Color: Green; Case Code (Metric): 1608; Case Code (Imperial): 0603; Min Operating Temperature: -40°C; Max Operating Temperature: 85°C; Package Quantity: 4000; Packaging: Tape and Reel; Dominant Wavelength: 520nm; Length: 1.6mm; Width: 0.8mm; Height: 0.7mm; REACH SVHC: Unknown; Lead Free: Lead Free; ComponentLink1URL: https://datasheet.ciiva.com/29562/150060gs75000-29562868.pdf?src-supplier=Digi-Key; ComponentLink1Description: https://datasheet.ciiva.com/29562/150060gs75000-29562868.pdf?src-supplier=Digi-Key; ComponentLink2URL: https://datasheet.ciiva.com/29279/759427-da-01-en-chipled-0603-w-kl-gruen-150060gs75000-29279201.pdf?src-supplier=Conrad; ComponentLink2Description: https://datasheet.ciiva.com/29279/759427-da-01-en-chipled-0603-w-kl-gruen-150060gs75000-29279201.pdf?src-supplier=Conrad; ComponentLink3URL: https://datasheet.ciiva.com/29562/150060gs75000-29562869.pdf?src-supplier=Digi-Key; ComponentLink3Description: https://datasheet.ciiva.com/29562/150060gs75000-29562869.pdf?src-supplier=Digi-Key; ComponentLink4URL: https://datasheet.ciiva.com/29562/150060gs75000-29562870.pdf?src-supplier=Digi-Key; ComponentLink4Description: https://datasheet.ciiva.com/29562/150060gs75000-29562870.pdf?src-supplier=Digi-Key
LED15 LED28 = 150060AS75000: Wurth Elektronik 0603 amber; Manufacturer: Wurth Electronics; Manufacturer Part Number: 150060GS75000; Color: Green; Wavelength: 520nm; Viewing Angle: 140°; Lens Style: Clear,Rectangular; Luminous Intensity: 430mcd; Forward Current: 30mA; Forward Voltage: 3.2V; Test Current: 20mA; Supplier 1: Digi-Key; RoHS: Yes; Category: LEDs; Stock 1: 71509; Pricing 1: 1=0.14000, 50=0.13300, 100=0.11400, 500=0.09900 (USD); Mount: Surface Mount; Case/Package: 0603; Case Code (Metric): 1608; Case Code (Imperial): 0603; Min Operating Temperature: -40°C; Max Operating Temperature: 85°C; Package Quantity: 4000; Packaging: Tape and Reel; Dominant Wavelength: 520nm; Length: 1.6mm; Width: 0.8mm; Height: 0.7mm; REACH SVHC: Unknown; Lead Free: Lead Free; ComponentLink1URL: https://datasheet.ciiva.com/29562/150060gs75000-29562868.pdf?src-supplier=Digi-Key; ComponentLink1Description: https://datasheet.ciiva.com/29562/150060gs75000-29562868.pdf?src-supplier=Digi-Key; ComponentLink2URL: https://datasheet.ciiva.com/29279/759427-da-01-en-chipled-0603-w-kl-gruen-150060gs75000-29279201.pdf?src-supplier=Conrad; ComponentLink2Description: https://datasheet.ciiva.com/29279/759427-da-01-en-chipled-0603-w-kl-gruen-150060gs75000-29279201.pdf?src-supplier=Conrad; ComponentLink3URL: https://datasheet.ciiva.com/29562/150060gs75000-29562869.pdf?src-supplier=Digi-Key; ComponentLink3Description: https://datasheet.ciiva.com/29562/150060gs75000-29562869.pdf?src-supplier=Digi-Key; ComponentLink4URL: https://datasheet.ciiva.com/29562/150060gs75000-29562870.pdf?src-supplier=Digi-Key; ComponentLink4Description: https://datasheet.ciiva.com/29562/150060gs75000-29562870.pdf?src-supplier=Digi-Key
LED16 = 150060BS75000: Wurth Elektronik 0603 blue; Manufacturer: Wurth Electronics; Manufacturer Part Number: 150060GS75000; Color: Green; Wavelength: 520nm; Viewing Angle: 140°; Lens Style: Clear,Rectangular; Luminous Intensity: 430mcd; Forward Current: 30mA; Forward Voltage: 3.2V; Test Current: 20mA; Supplier 1: Digi-Key; RoHS: Yes; Category: LEDs; Stock 1: 71509; Pricing 1: 1=0.14000, 50=0.13300, 100=0.11400, 500=0.09900 (USD); Mount: Surface Mount; Case/Package: 0603; Case Code (Metric): 1608; Case Code (Imperial): 0603; Min Operating Temperature: -40°C; Max Operating Temperature: 85°C; Package Quantity: 4000; Packaging: Tape and Reel; Dominant Wavelength: 520nm; Length: 1.6mm; Width: 0.8mm; Height: 0.7mm; REACH SVHC: Unknown; Lead Free: Lead Free; ComponentLink1URL: https://datasheet.ciiva.com/29562/150060gs75000-29562868.pdf?src-supplier=Digi-Key; ComponentLink1Description: https://datasheet.ciiva.com/29562/150060gs75000-29562868.pdf?src-supplier=Digi-Key; ComponentLink2URL: https://datasheet.ciiva.com/29279/759427-da-01-en-chipled-0603-w-kl-gruen-150060gs75000-29279201.pdf?src-supplier=Conrad; ComponentLink2Description: https://datasheet.ciiva.com/29279/759427-da-01-en-chipled-0603-w-kl-gruen-150060gs75000-29279201.pdf?src-supplier=Conrad; ComponentLink3URL: https://datasheet.ciiva.com/29562/150060gs75000-29562869.pdf?src-supplier=Digi-Key; ComponentLink3Description: https://datasheet.ciiva.com/29562/150060gs75000-29562869.pdf?src-supplier=Digi-Key; ComponentLink4URL: https://datasheet.ciiva.com/29562/150060gs75000-29562870.pdf?src-supplier=Digi-Key; ComponentLink4Description: https://datasheet.ciiva.com/29562/150060gs75000-29562870.pdf?src-supplier=Digi-Key
LED26 LED27 = 150060RS75000: Wurth Elektronik 0603 red; Manufacturer: Wurth Electronics; Manufacturer Part Number: 150060GS75000; Color: Green; Wavelength: 520nm; Viewing Angle: 140°; Lens Style: Clear,Rectangular; Luminous Intensity: 430mcd; Forward Current: 30mA; Forward Voltage: 3.2V; Test Current: 20mA; Supplier 1: Digi-Key; RoHS: Yes; Category: LEDs; Stock 1: 71509; Pricing 1: 1=0.14000, 50=0.13300, 100=0.11400, 500=0.09900 (USD); Mount: Surface Mount; Case/Package: 0603; Case Code (Metric): 1608; Case Code (Imperial): 0603; Min Operating Temperature: -40°C; Max Operating Temperature: 85°C; Package Quantity: 4000; Packaging: Tape and Reel; Dominant Wavelength: 520nm; Length: 1.6mm; Width: 0.8mm; Height: 0.7mm; REACH SVHC: Unknown; Lead Free: Lead Free; ComponentLink1URL: https://datasheet.ciiva.com/29562/150060gs75000-29562868.pdf?src-supplier=Digi-Key; ComponentLink1Description: https://datasheet.ciiva.com/29562/150060gs75000-29562868.pdf?src-supplier=Digi-Key; ComponentLink2URL: https://datasheet.ciiva.com/29279/759427-da-01-en-chipled-0603-w-kl-gruen-150060gs75000-29279201.pdf?src-supplier=Conrad; ComponentLink2Description: https://datasheet.ciiva.com/29279/759427-da-01-en-chipled-0603-w-kl-gruen-150060gs75000-29279201.pdf?src-supplier=Conrad; ComponentLink3URL: https://datasheet.ciiva.com/29562/150060gs75000-29562869.pdf?src-supplier=Digi-Key; ComponentLink3Description: https://datasheet.ciiva.com/29562/150060gs75000-29562869.pdf?src-supplier=Digi-Key; ComponentLink4URL: https://datasheet.ciiva.com/29562/150060gs75000-29562870.pdf?src-supplier=Digi-Key; ComponentLink4Description: https://datasheet.ciiva.com/29562/150060gs75000-29562870.pdf?src-supplier=Digi-Key
R116-R130 R132-R141 R149 R153-R162 R166-R173 R192-R201 = RC0603FR-13180RL: YAGEO 0603 180 ohm; Manufacturer_Name: KEMET; Manufacturer_Part_Number: RC0603JR-070RL; Geometry.Height: 0.55mm; Mouser Part Number: 603-RC0603JR-070RL; Mouser Price/Stock: https://www.mouser.co.uk/ProductDetail/YAGEO/RC0603JR-070RL?qs=2cAdsCoAWRGWyPcuXgGiXQ%3D%3D; Datasheet Link: https://datasheet.datasheetarchive.com/originals/distributors/Datasheets_SAMA/902f9e387b938f871d31120f5fc1d65e.pdf
R131 = RC0603FR-10100RL: YAGEO 0603 100 ohm; Manufacturer_Name: KEMET; Manufacturer_Part_Number: RC0603JR-070RL; Geometry.Height: 0.55mm; Mouser Part Number: 603-RC0603JR-070RL; Mouser Price/Stock: https://www.mouser.co.uk/ProductDetail/YAGEO/RC0603JR-070RL?qs=2cAdsCoAWRGWyPcuXgGiXQ%3D%3D; Datasheet Link: https://datasheet.datasheetarchive.com/originals/distributors/Datasheets_SAMA/902f9e387b938f871d31120f5fc1d65e.pdf
R142-R148 R151 R152 R163-R165 R174-R191 R202-R227 = RC0603JR-070RL: as R1 on sheet Display_CPu; Mouser Part Number: 603-RC0603JR-070RL; Mouser Price/Stock: https://www.mouser.co.uk/ProductDetail/YAGEO/RC0603JR-070RL?qs=2cAdsCoAWRGWyPcuXgGiXQ%3D%3D; Manufacturer_Part_Number: RC0603JR-070RL; Datasheet Link: https://datasheet.datasheetarchive.com/originals/distributors/Datasheets_SAMA/902f9e387b938f871d31120f5fc1d65e.pdf
R150 = RC0603FR-0747KL: YAGEO 0603 47; Manufacturer_Name: KEMET; Manufacturer_Part_Number: RC0603JR-070RL; Geometry.Height: 0.55mm; Mouser Part Number: 603-RC0603JR-070RL; Mouser Price/Stock: https://www.mouser.co.uk/ProductDetail/YAGEO/RC0603JR-070RL?qs=2cAdsCoAWRGWyPcuXgGiXQ%3D%3D; Datasheet Link: https://datasheet.datasheetarchive.com/originals/distributors/Datasheets_SAMA/902f9e387b938f871d31120f5fc1d65e.pdf
TP8-TP11 = TP: as TP1 on sheet Display_CPu; Supplier 1: Digi-Key; RoHS: Yes; Category: Headers and Wire Housings; Stock 1: 227; Pricing 1: 1=2.85000, 10=2.73600, 100=2.28000, 500=1.93800, 1000=1.65300, 5000=1.48200 (USD); Mount: Through Hole; Contact Plating: Gold; Contact Material: Bronze; Housing Material: Polyester; Housing Color: Black; Color: Black; Min Operating Temperature: -55°C; Max Operating Temperature: 125°C; Number of Rows: 2; Termination: Solder; Packaging: Rail/Tube; Orientation: Straight; Number of Positions: 16; Length: 27.94mm; Depth: 9.27mm; Contact Mating Length: 0.25inch; REACH SVHC: No SVHC; ComponentLink1URL: https://datasheet.ciiva.com/739/tst-mkt-739845.pdf?src-supplier=Digi-Key; ComponentLink1Description: https://datasheet.ciiva.com/739/tst-mkt-739845.pdf?src-supplier=Digi-Key; ComponentLink2URL: https://datasheet.ciiva.com/10018/htst-10018510.pdf?src-supplier=Avnet; ComponentLink2Description: https://datasheet.ciiva.com/10018/htst-10018510.pdf?src-supplier=Avnet
U1 U4 = SN74ABT240ADBR: Octal Buffers/Drivers With 3-State Outputs; Manufacturer_Name: Texas Instruments; Geometry.Height: 2mm; Mouser Part Number: 595-SN74ABT240ADBR; Mouser Price/Stock: https://www.mouser.co.uk/ProductDetail/Texas-Instruments/SN74ABT240ADBR?qs=JHHQeKcAU3Dt82k%252BVyiYdw%3D%3D; Manufacturer_Part_Number: SN74ABT240ADBR; Datasheet Link: http://www.ti.com/lit/gpn/sn74abt240a
U2 U3 U5 U6 = SN74AC04PWR: Hex Inverters; Manufacturer_Name: Texas Instruments; Geometry.Height: 1.2mm; Mouser Part Number: 595-SN74AC04PWR; Mouser Price/Stock: https://www.mouser.co.uk/ProductDetail/Texas-Instruments/SN74AC04PWR?qs=RZS%252BpEsUn7pRvPNqsga4SA%3D%3D; Manufacturer_Part_Number: SN74AC04PWR; Datasheet Link: http://www.ti.com/lit/gpn/sn74ac04

## Nets that join several sheets
+3.3: Display_CPu (H1.3 TP1.1), Display_LED_Monitor (R150.1)
+5: Display_CPu (21 pins), Display_LED_Monitor (61 pins)
GND: Display_CPu (20 pins), Display_LED_Monitor (12 pins)
CPU_CS: Display_CPu (R12.2 R43.2), Display_LED_Monitor (R142.1)
CPU_D0: Display_CPu (R1.1 R17.1), Display_LED_Monitor (U1.2)
CPU_D1: Display_CPu (R3.1 R19.1), Display_LED_Monitor (U1.4)
CPU_D2: Display_CPu (R6.1 R21.1), Display_LED_Monitor (U1.6)
CPU_D3: Display_CPu (R9.1 R25.1), Display_LED_Monitor (U1.8)
CPU_D4: Display_CPu (R11.1 R27.1), Display_LED_Monitor (U1.11)
CPU_D5: Display_CPu (R13.1 R29.1), Display_LED_Monitor (U1.13)
CPU_D6: Display_CPu (R15.1 R31.1), Display_LED_Monitor (U1.15)
CPU_D7: Display_CPu (R16.1 R33.1), Display_LED_Monitor (U1.17)
CPU_nInt: Display_CPu (R7.2 R45.2), Display_LED_Monitor (R143.1)
CPU_Reset: Display_CPu (R14.2 R20.2), Display_LED_Monitor (R145.1)
CPU_RnW: Display_CPu (R10.2 R44.2), Display_LED_Monitor (R163.1 R164.1)
I2C_SDA: Display_CPu (J2.2 R40.1 R46.1), Display_LED_Monitor (R202.1)
I2C_SDC: Display_CPu (J1.2 R42.1 R47.1), Display_LED_Monitor (R190.1)
LCD1_CnD: Display_CPu (R52.1 R53.2), Display_LED_Monitor (R174.1 R204.1)
LCD1_Extra: Display_CPu (R77.1 R79.2), Display_LED_Monitor (R210.1)
LCD1_FS: Display_CPu (R74.1 R76.2), Display_LED_Monitor (R208.1)
LCD1_Mid: Display_CPu (R70.1 R73.2), Display_LED_Monitor (R187.1 R206.1)
LCD1_nCE: Display_CPu (R66.1 R69.2), Display_LED_Monitor (R182.1)
LCD1_nRD: Display_CPu (R54.1 R57.2), Display_LED_Monitor (R175.1)
LCD1_nWR: Display_CPu (R58.1 R61.2), Display_LED_Monitor (R176.1)
LCD1_Reset: Display_CPu (R62.1 R65.2), Display_LED_Monitor (R179.1)
LCD2_DnI: Display_CPu (R92.1 R111.2), Display_LED_Monitor (R218.1 R219.1)
LCD2_Enable: Display_CPu (R95.1 R113.2), Display_LED_Monitor (R220.1)
LCD2_Extra_1: Display_CPu (R98.1 R114.2), Display_LED_Monitor (R222.1)
LCD2_Extra_2: Display_CPu (R101.1 R115.2), Display_LED_Monitor (R223.1)
LCD2_nCS1: Display_CPu (R81.1 R100.2), Display_LED_Monitor (R214.1)
LCD2_nCS2: Display_CPu (R83.1 R104.2), Display_LED_Monitor (R215.1)
LCD2_Reset: Display_CPu (R86.1 R106.2), Display_LED_Monitor (R216.1)
LCD2_RnW: Display_CPu (R89.1 R109.2), Display_LED_Monitor (R212.1 R221.1)
LCD_D0: Display_CPu (H4.2 H7.2 R82.2), Display_LED_Monitor (U4.2)
LCD_D1: Display_CPu (H4.3 H7.3 R85.2), Display_LED_Monitor (U4.4)
LCD_D2: Display_CPu (H4.4 H7.4 R88.2), Display_LED_Monitor (U4.6)
LCD_D3: Display_CPu (H4.5 H7.5 R91.2), Display_LED_Monitor (U4.8)
LCD_D4: Display_CPu (H4.6 H7.6 R94.2), Display_LED_Monitor (U4.11)
LCD_D5: Display_CPu (H4.7 H7.7 R97.2), Display_LED_Monitor (U4.13)
LCD_D6: Display_CPu (H4.8 H7.8 R99.2), Display_LED_Monitor (U4.15)
LCD_D7: Display_CPu (H4.9 H7.9 R102.2), Display_LED_Monitor (U4.17)
nOE: Display_CPu (R26.2 R60.1 R87.1 R105.1), Display_LED_Monitor (R144.1)
RCLK: Display_CPu (R28.2 R64.1 R90.1 R108.1), Display_LED_Monitor (R177.1)
SCLK: Display_CPu (R30.2 R68.1 R93.1 R110.1), Display_LED_Monitor (R180.1)
SCLR: Display_CPu (R32.2 R72.1 R96.1 R112.1), Display_LED_Monitor (R146.1)
SER_Data_0: Display_CPu (R22.2 R84.1), Display_LED_Monitor (R148.1)
SER_Data_1: Display_CPu (R56.1 R107.2), Display_LED_Monitor (R151.1)
SER_Data_2: Display_CPu (R80.2 R103.1), Display_LED_Monitor (R152.1)
SPI_MISO: Display_CPu (R39.2 R50.1), Display_LED_Monitor (R185.1)
SPI_MOSI: Display_CPu (R41.2 R51.1), Display_LED_Monitor (R188.1)
SPI_SCK: Display_CPu (R37.2 R49.1), Display_LED_Monitor (R183.1)
SPI_SS: Display_CPu (R35.2 R48.1), Display_LED_Monitor (R147.1)